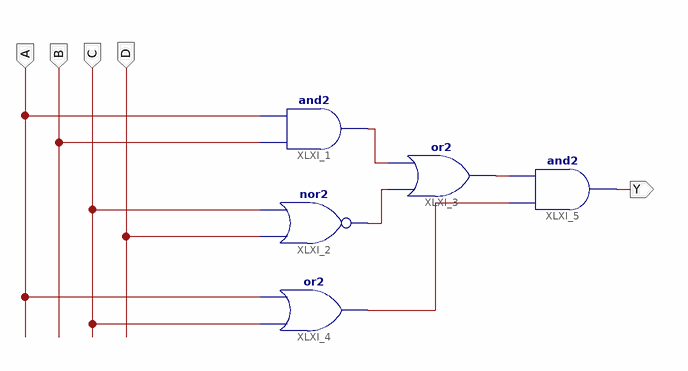
[diagram p0: schematic sheet 1]
// Xilinx ISE schematic shema.sch (xc9500) as structural Verilog: 5 symbols, 5 ports
module shema (
  input  A,
  input  B,
  input  C,
  input  D,
  output Y
);

  wire XLXN_3, XLXN_4, XLXN_5, XLXN_6;

  and XLXI_1 (XLXN_3, B, A);
  nor XLXI_2 (XLXN_4, D, C);
  or XLXI_3 (XLXN_5, XLXN_4, XLXN_3);
  or XLXI_4 (XLXN_6, C, A);
  and XLXI_5 (Y, XLXN_6, XLXN_5);
endmodule
